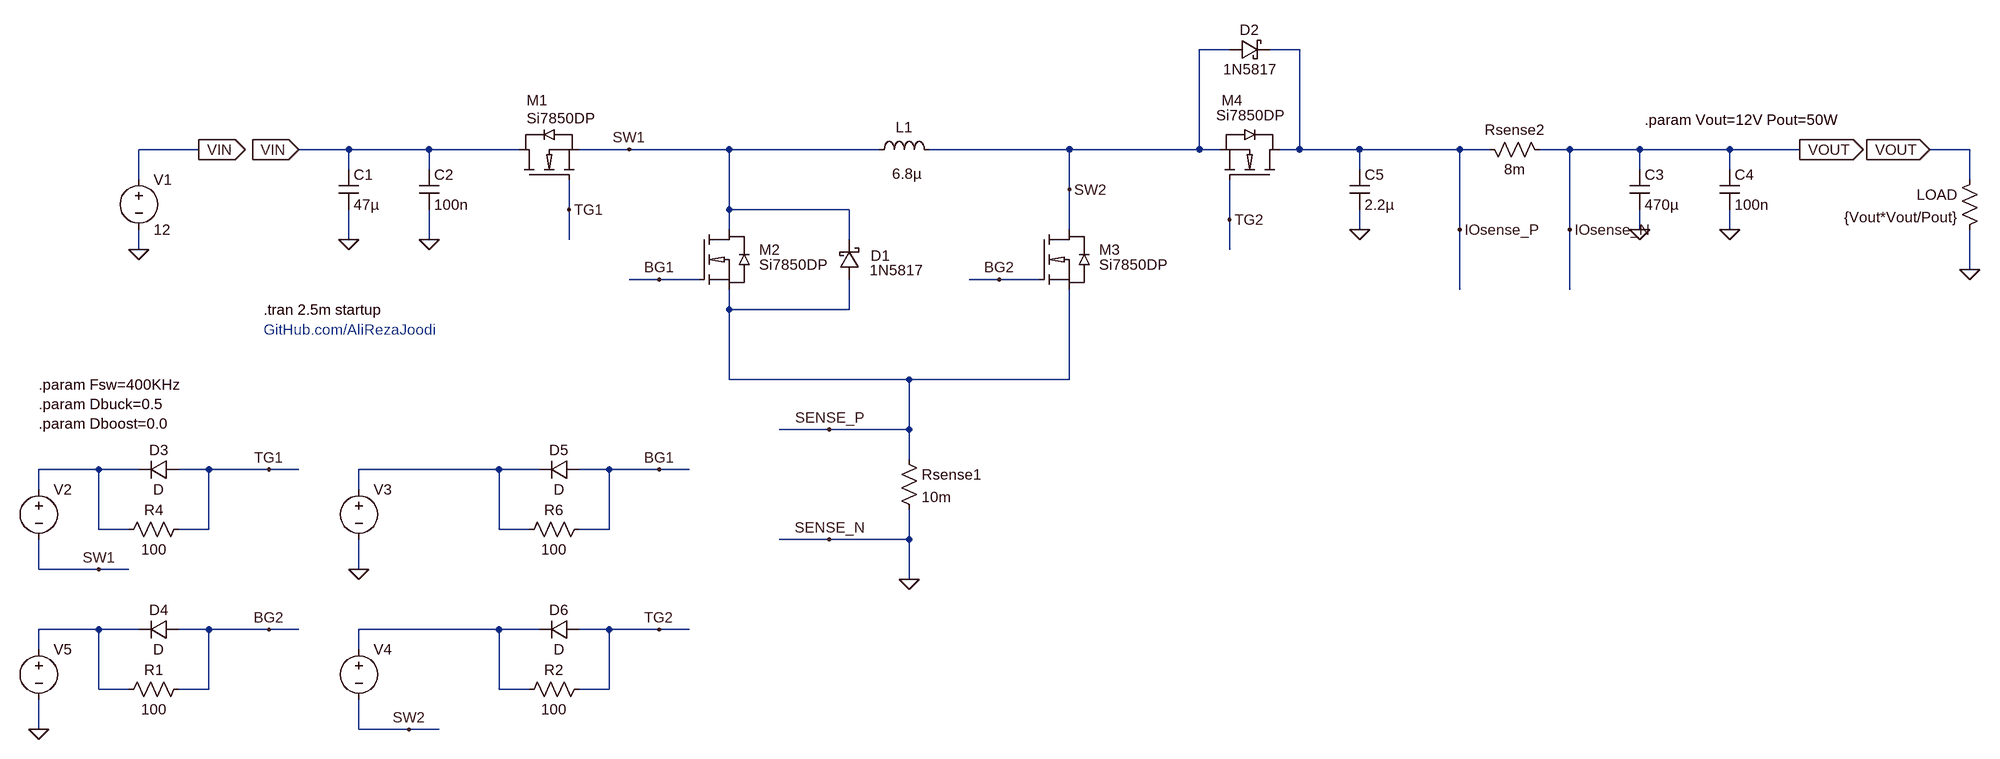
[diagram p0: schematic _PowerStage.asc]
_PowerStage.asc, the LTspice schematic file:
Version 4.1
SHEET 1 2228 2032
WIRE 752 -1568 704 -1568
WIRE 864 -1568 816 -1568
WIRE -896 -1408 -992 -1408
WIRE -656 -1408 -736 -1408
WIRE -528 -1408 -656 -1408
WIRE -384 -1408 -528 -1408
WIRE -208 -1408 -288 -1408
WIRE -48 -1408 -208 -1408
WIRE 192 -1408 -48 -1408
WIRE 496 -1408 272 -1408
WIRE 704 -1408 704 -1568
WIRE 704 -1408 496 -1408
WIRE 736 -1408 704 -1408
WIRE 864 -1408 864 -1568
WIRE 864 -1408 832 -1408
WIRE 960 -1408 864 -1408
WIRE 1120 -1408 960 -1408
WIRE 1168 -1408 1120 -1408
WIRE 1296 -1408 1248 -1408
WIRE 1408 -1408 1296 -1408
WIRE 1552 -1408 1408 -1408
WIRE 1664 -1408 1552 -1408
WIRE 1936 -1408 1872 -1408
WIRE -656 -1376 -656 -1408
WIRE -528 -1376 -528 -1408
WIRE 960 -1376 960 -1408
WIRE 1408 -1376 1408 -1408
WIRE 1552 -1376 1552 -1408
WIRE -992 -1360 -992 -1408
WIRE 1936 -1360 1936 -1408
WIRE 496 -1344 496 -1408
WIRE -304 -1312 -304 -1360
WIRE -48 -1312 -48 -1408
WIRE 144 -1312 -48 -1312
WIRE 752 -1296 752 -1360
WIRE -48 -1280 -48 -1312
WIRE 496 -1280 496 -1344
WIRE 960 -1280 960 -1312
WIRE 1120 -1280 1120 -1408
WIRE 1296 -1280 1296 -1408
WIRE 1408 -1280 1408 -1312
WIRE 1552 -1280 1552 -1312
WIRE -656 -1264 -656 -1312
WIRE -528 -1264 -528 -1312
WIRE -304 -1264 -304 -1312
WIRE 144 -1264 144 -1312
WIRE -992 -1248 -992 -1280
WIRE 752 -1248 752 -1296
WIRE 1936 -1216 1936 -1280
WIRE -160 -1200 -208 -1200
WIRE -96 -1200 -160 -1200
WIRE 384 -1200 336 -1200
WIRE 448 -1200 384 -1200
WIRE 1120 -1184 1120 -1280
WIRE 1296 -1184 1296 -1280
WIRE -48 -1152 -48 -1184
WIRE 144 -1152 144 -1200
WIRE 144 -1152 -48 -1152
WIRE -48 -1040 -48 -1152
WIRE 240 -1040 -48 -1040
WIRE 496 -1040 496 -1184
WIRE 496 -1040 240 -1040
WIRE 112 -960 32 -960
WIRE 240 -960 240 -1040
WIRE 240 -960 112 -960
WIRE 240 -912 240 -960
WIRE -1056 -896 -1152 -896
WIRE -992 -896 -1056 -896
WIRE -880 -896 -928 -896
WIRE -784 -896 -880 -896
WIRE -736 -896 -784 -896
WIRE -416 -896 -640 -896
WIRE -352 -896 -416 -896
WIRE -240 -896 -288 -896
WIRE -160 -896 -240 -896
WIRE -112 -896 -160 -896
WIRE -1152 -864 -1152 -896
WIRE -640 -864 -640 -896
WIRE -1056 -800 -1056 -896
WIRE -1008 -800 -1056 -800
WIRE -880 -800 -880 -896
WIRE -880 -800 -928 -800
WIRE -416 -800 -416 -896
WIRE -368 -800 -416 -800
WIRE -240 -800 -240 -896
WIRE -240 -800 -288 -800
WIRE 112 -784 32 -784
WIRE 240 -784 240 -832
WIRE 240 -784 112 -784
WIRE -1152 -736 -1152 -784
WIRE -1056 -736 -1152 -736
WIRE -1008 -736 -1056 -736
WIRE -640 -736 -640 -784
WIRE 240 -720 240 -784
WIRE -1056 -640 -1152 -640
WIRE -992 -640 -1056 -640
WIRE -880 -640 -928 -640
WIRE -784 -640 -880 -640
WIRE -736 -640 -784 -640
WIRE -416 -640 -640 -640
WIRE -352 -640 -416 -640
WIRE -240 -640 -288 -640
WIRE -160 -640 -240 -640
WIRE -112 -640 -160 -640
WIRE -1152 -608 -1152 -640
WIRE -640 -608 -640 -640
WIRE -1056 -544 -1056 -640
WIRE -1008 -544 -1056 -544
WIRE -880 -544 -880 -640
WIRE -880 -544 -928 -544
WIRE -416 -544 -416 -640
WIRE -368 -544 -416 -544
WIRE -240 -544 -240 -640
WIRE -240 -544 -288 -544
WIRE -1152 -480 -1152 -528
WIRE -640 -480 -640 -528
WIRE -560 -480 -640 -480
WIRE -512 -480 -560 -480
FLAG -992 -1248 0
FLAG 240 -720 0
FLAG 1936 -1216 0
FLAG 1872 -1408 VOUT
IOPIN 1872 -1408 In
FLAG 1408 -1280 0
FLAG 384 -1200 BG2
FLAG 752 -1296 TG2
FLAG 496 -1344 SW2
FLAG -304 -1312 TG1
FLAG -160 -1200 BG1
FLAG -208 -1408 SW1
FLAG 1296 -1280 IOsense_N
FLAG 1120 -1280 IOsense_P
FLAG 112 -784 SENSE_N
FLAG 112 -960 SENSE_P
FLAG 1552 -1280 0
FLAG -656 -1264 0
FLAG -528 -1264 0
FLAG -896 -1408 VIN
IOPIN -896 -1408 Out
FLAG -736 -1408 VIN
IOPIN -736 -1408 In
FLAG 1664 -1408 VOUT
IOPIN 1664 -1408 Out
FLAG 960 -1280 0
FLAG -1056 -736 SW1
FLAG -784 -896 TG1
FLAG -640 -736 0
FLAG -160 -896 BG1
FLAG -1152 -480 0
FLAG -784 -640 BG2
FLAG -560 -480 SW2
FLAG -160 -640 TG2
SYMBOL voltage -992 -1376 R0
WINDOW 123 0 0 Left 0
WINDOW 39 0 0 Left 0
SYMATTR InstName V1
SYMATTR Value 12
SYMBOL res 224 -928 R0
SYMATTR InstName Rsense1
SYMATTR Value 10m
SYMBOL schottky 128 -1200 M180
WINDOW 0 50 38 Left 2
WINDOW 3 49 15 Left 2
SYMATTR InstName D1
SYMATTR Value 1N5817
SYMATTR Description Diode
SYMATTR Type diode
SYMBOL schottky 752 -1552 R270
WINDOW 0 32 32 VTop 2
WINDOW 3 0 32 VBottom 2
SYMATTR InstName D2
SYMATTR Value 1N5817
SYMATTR Description Diode
SYMATTR Type diode
SYMBOL ind 176 -1392 R270
WINDOW 0 36 56 VTop 2
WINDOW 3 -7 60 VBottom 2
SYMATTR InstName L1
SYMATTR Value 6.8µ
SYMATTR SpiceLine Rpar=1K
SYMBOL res 1152 -1424 M90
WINDOW 0 0 56 VBottom 2
WINDOW 3 32 56 VTop 2
SYMATTR InstName Rsense2
SYMATTR Value 8m
SYMBOL cap 1392 -1376 R0
SYMATTR InstName C3
SYMATTR Value 470µ
SYMATTR SpiceLine Rser=20m
SYMBOL res 1952 -1376 M0
SYMATTR InstName LOAD
SYMATTR Value {Vout*Vout/Pout}
SYMBOL cap 1536 -1376 R0
SYMATTR InstName C4
SYMATTR Value 100n
SYMATTR SpiceLine Rser=100m
SYMBOL cap -672 -1376 R0
SYMATTR InstName C1
SYMATTR Value 47µ
SYMBOL cap -544 -1376 R0
SYMATTR InstName C2
SYMATTR Value 100n
SYMBOL MyLib\\Transistor_MOSFET_N\\MOSFET_N -384 -1360 R270
WINDOW 0 127 12 VRight 2
WINDOW 3 98 12 VRight 2
SYMATTR InstName M1
SYMATTR Value Si7850DP
SYMBOL MyLib\\Transistor_MOSFET_N\\MOSFET_N -96 -1280 R0
SYMATTR InstName M2
SYMATTR Value Si7850DP
SYMBOL MyLib\\Transistor_MOSFET_N\\MOSFET_N 448 -1280 R0
SYMATTR InstName M3
SYMATTR Value Si7850DP
SYMBOL MyLib\\Transistor_MOSFET_N\\MOSFET_N 832 -1360 M270
WINDOW 0 127 59 VRight 2
WINDOW 3 103 -7 VRight 2
SYMATTR InstName M4
SYMATTR Value Si7850DP
SYMBOL cap 944 -1376 R0
SYMATTR InstName C5
SYMATTR Value 2.2µ
SYMATTR SpiceLine Rser=100m
SYMBOL voltage -1152 -880 R0
WINDOW 3 41 64 Invisible 2
WINDOW 123 0 0 Left 0
WINDOW 39 0 0 Left 0
SYMATTR Value PULSE(0 12 0 {0.01/Fsw} {0.01/Fsw} {Dbuck/Fsw} {1/Fsw})
SYMATTR InstName V2
SYMBOL voltage -640 -880 R0
WINDOW 3 41 64 Invisible 2
WINDOW 123 0 0 Left 0
WINDOW 39 0 0 Left 0
SYMATTR Value PULSE(12 0 0 {0.01/Fsw} {0.01/Fsw} {Dbuck/Fsw} {1/Fsw})
SYMATTR InstName V3
SYMBOL voltage -640 -624 R0
WINDOW 3 41 64 Invisible 2
WINDOW 123 0 0 Left 0
WINDOW 39 0 0 Left 0
SYMATTR Value PULSE(12 0 0 {0.01/Fsw} {0.01/Fsw} {Dboost/Fsw} {1/Fsw})
SYMATTR InstName V4
SYMBOL voltage -1152 -624 R0
WINDOW 3 41 64 Invisible 2
WINDOW 123 0 0 Left 0
WINDOW 39 0 0 Left 0
SYMATTR Value PULSE(0 12 0 {0.01/Fsw} {0.01/Fsw} {Dboost/Fsw} {1/Fsw})
SYMATTR InstName V5
SYMBOL diode -928 -656 R90
WINDOW 0 0 32 VBottom 2
WINDOW 3 32 32 VTop 2
SYMATTR InstName D4
SYMBOL res -1024 -528 R270
WINDOW 0 32 56 VTop 2
WINDOW 3 0 56 VBottom 2
SYMATTR InstName R1
SYMATTR Value 100
SYMBOL diode -288 -656 R90
WINDOW 0 0 32 VBottom 2
WINDOW 3 32 32 VTop 2
SYMATTR InstName D6
SYMBOL res -384 -528 R270
WINDOW 0 32 56 VTop 2
WINDOW 3 0 56 VBottom 2
SYMATTR InstName R2
SYMATTR Value 100
SYMBOL diode -928 -912 R90
WINDOW 0 0 32 VBottom 2
WINDOW 3 32 32 VTop 2
SYMATTR InstName D3
SYMBOL res -1024 -784 R270
WINDOW 0 32 56 VTop 2
WINDOW 3 0 56 VBottom 2
SYMATTR InstName R4
SYMATTR Value 100
SYMBOL diode -288 -912 R90
WINDOW 0 0 32 VBottom 2
WINDOW 3 32 32 VTop 2
SYMATTR InstName D5
SYMBOL res -384 -784 R270
WINDOW 0 32 56 VTop 2
WINDOW 3 0 56 VBottom 2
SYMATTR InstName R6
SYMATTR Value 100
TEXT -792 -1152 Left 2 !.tran 2.5m startup
TEXT 1416 -1456 Left 2 !.param Vout=12V Pout=50W
TEXT -792 -1120 Left 2 ;GitHub.com/AliRezaJoodi
TEXT -1152 -1032 Left 2 !.param Fsw=400KHz\n.param Dbuck=0.5\n.param Dboost=0.0

The netlist it stands for:
* _PowerStage.asc
V1 VIN 0 12
Rsense1 SENSE_P 0 10m
D1 SENSE_P SW1 1N5817
D2 SW2 IOsense_P 1N5817
L1 SW1 SW2 6.8µ Rpar=1K
Rsense2 IOsense_P IOsense_N 8m
C3 IOsense_N 0 470µ Rser=20m
R§LOAD IOsense_N 0 {Vout*Vout/Pout}
C4 IOsense_N 0 100n Rser=100m
C1 VIN 0 47µ
C2 VIN 0 100n
M1 VIN TG1 SW1 SW1 Si7850DP
M2 SW1 BG1 SENSE_P SENSE_P Si7850DP
M3 SW2 BG2 SENSE_P SENSE_P Si7850DP
M4 IOsense_P TG2 SW2 SW2 Si7850DP
C5 IOsense_P 0 2.2µ Rser=100m
V2 N001 SW1 PULSE(0 12 0 {0.01/Fsw} {0.01/Fsw} {Dbuck/Fsw} {1/Fsw})
V3 N002 0 PULSE(12 0 0 {0.01/Fsw} {0.01/Fsw} {Dbuck/Fsw} {1/Fsw})
V4 N004 SW2 PULSE(12 0 0 {0.01/Fsw} {0.01/Fsw} {Dboost/Fsw} {1/Fsw})
V5 N003 0 PULSE(0 12 0 {0.01/Fsw} {0.01/Fsw} {Dboost/Fsw} {1/Fsw})
D4 BG2 N003 D
R1 N003 BG2 100
D6 TG2 N004 D
R2 N004 TG2 100
D3 TG1 N001 D
R4 N001 TG1 100
D5 BG1 N002 D
R6 N002 BG1 100
.model D D
.lib standard.dio
.model NMOS NMOS
.model PMOS PMOS
.lib standard.mos
.tran 2.5m startup
.param Vout=12V Pout=50W
* GitHub.com/AliRezaJoodi
.param Fsw=400KHz
.param Dbuck=0.5
.param Dboost=0.0
.backanno
.end